# Altium schematic sheet np001.schdoc
size A2
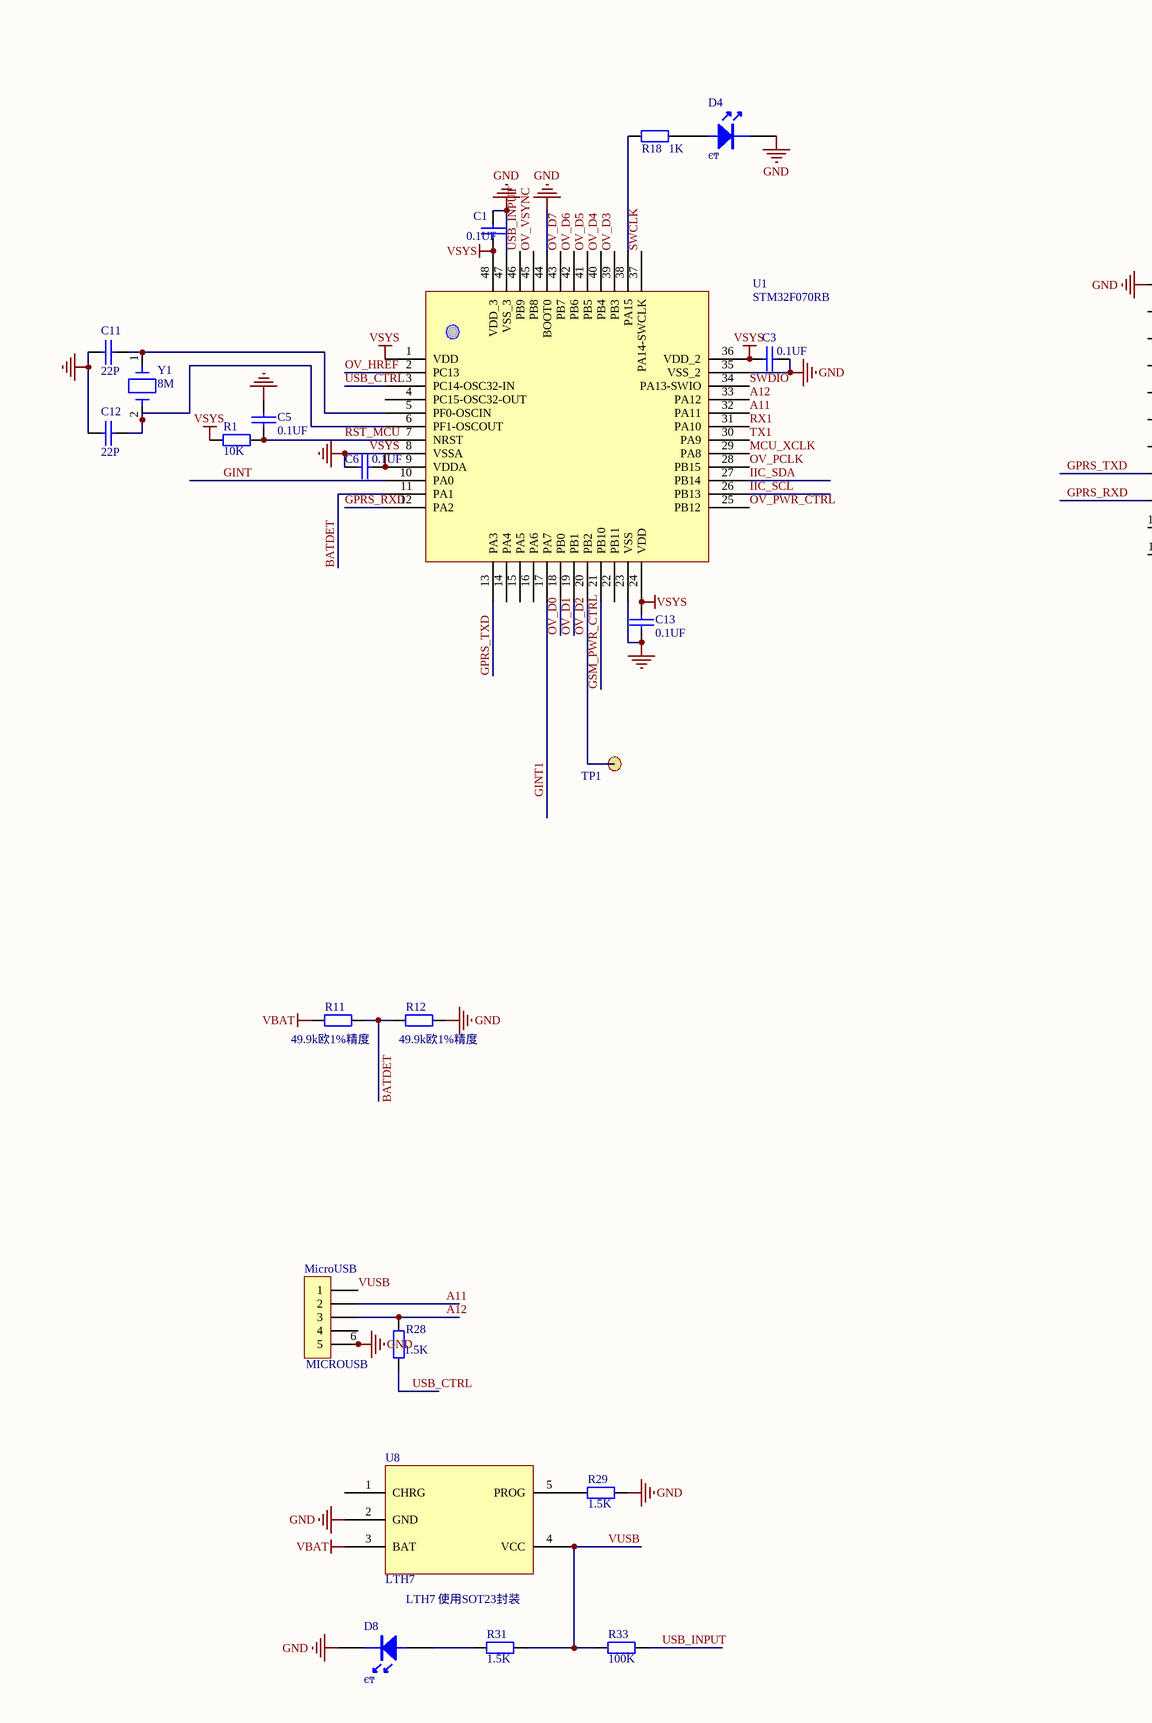
[diagram p0: np001.schdoc, left]
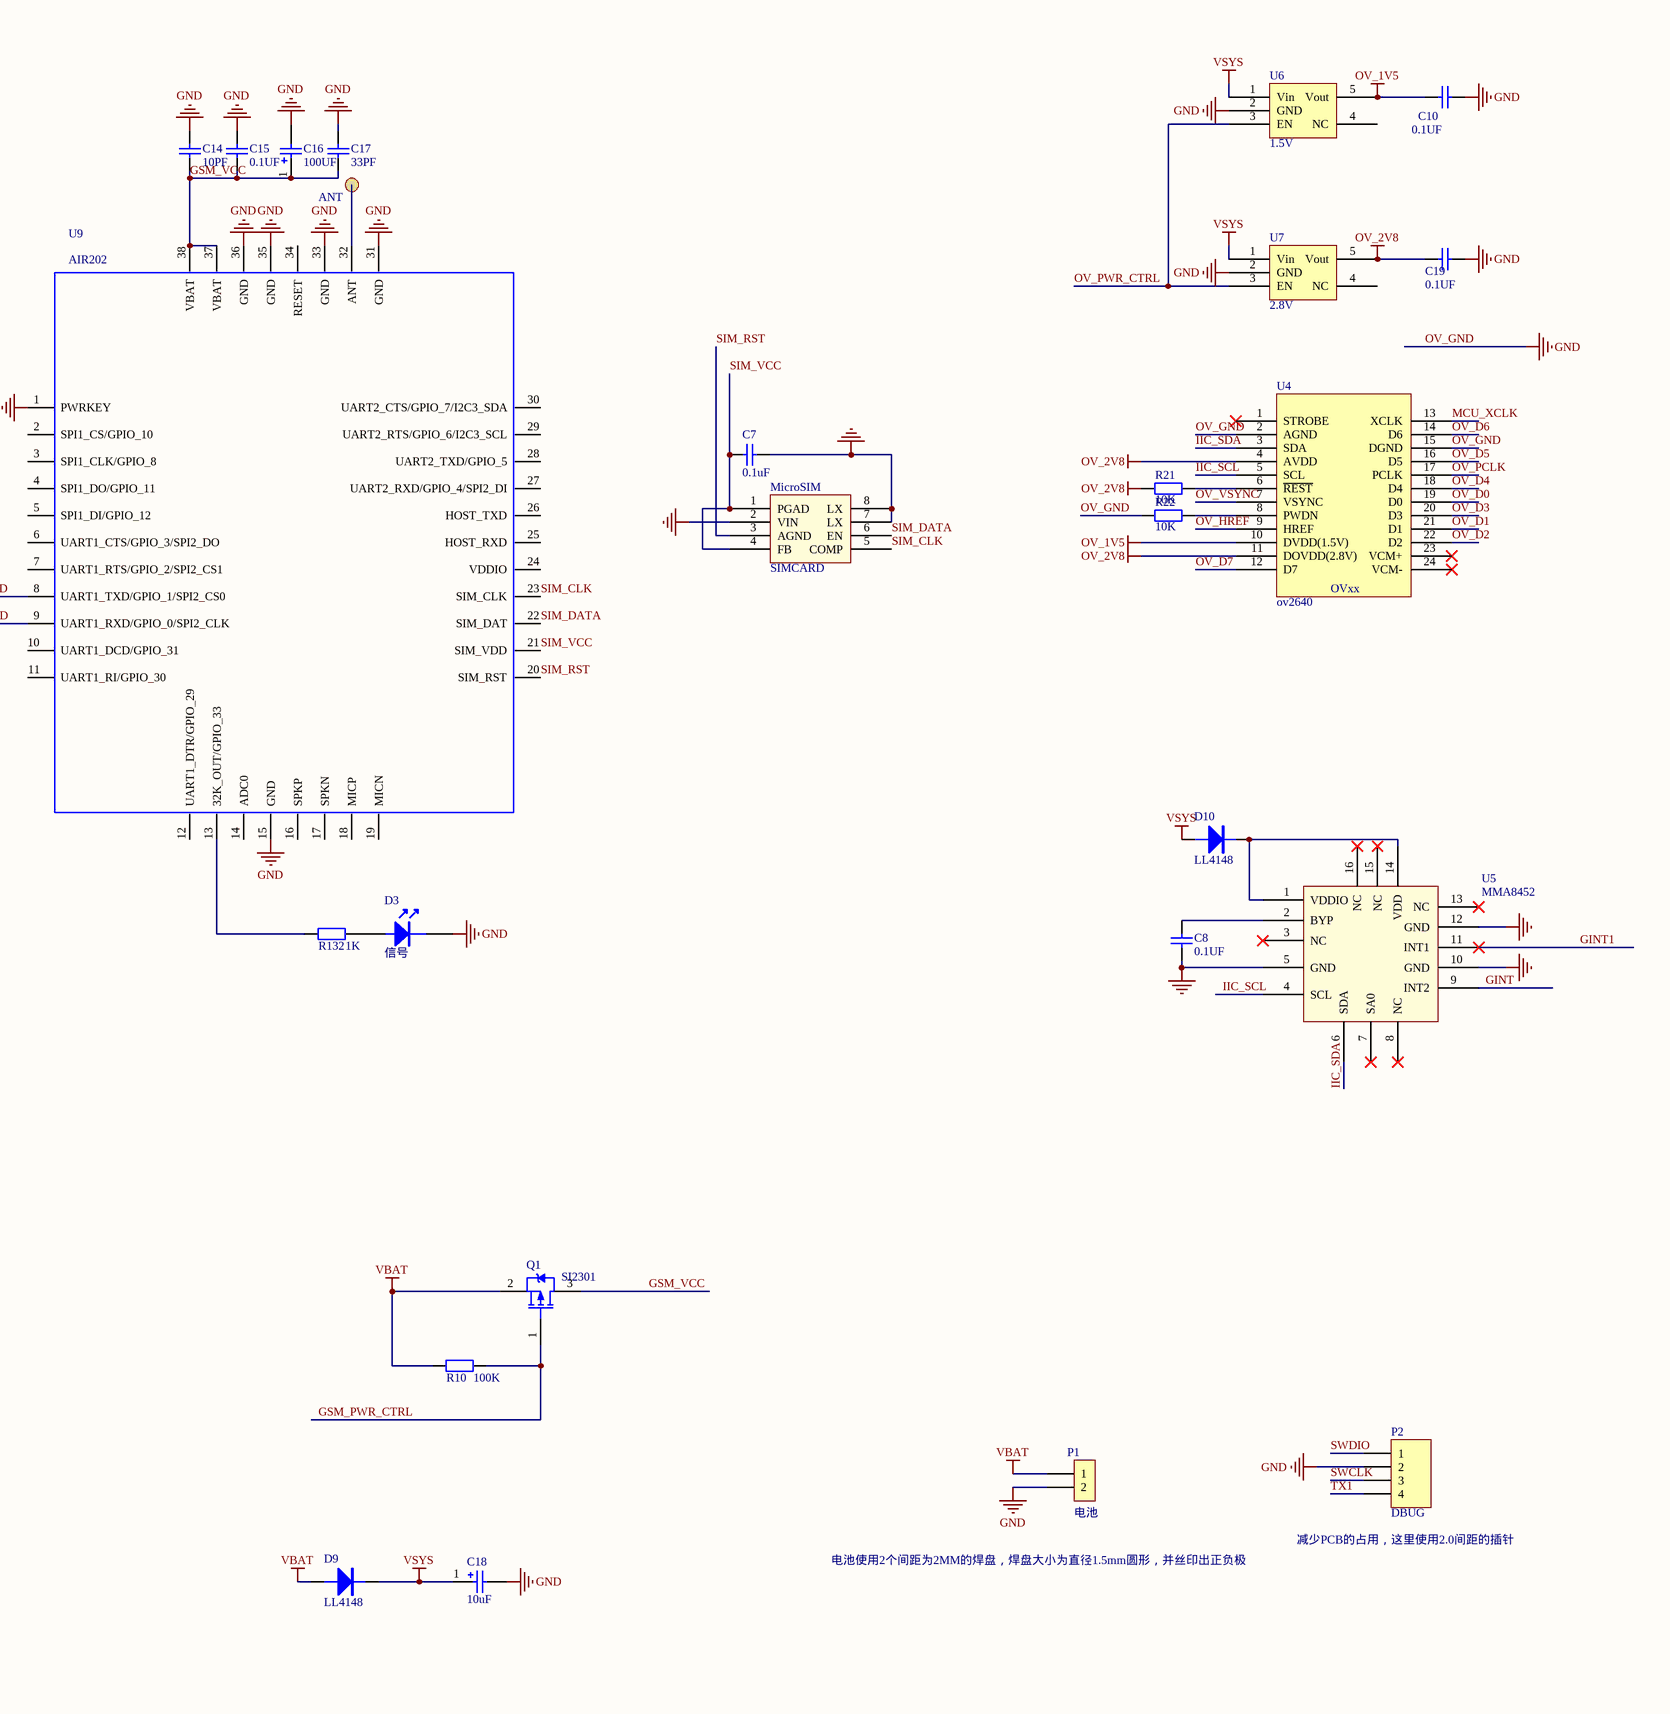
[diagram p1: np001.schdoc, right]

## Parts
ANT  TP  [CON1]  (value not drawn)
C1  0.1UF  [0603]
C3  0.1UF  [0603]
C5  0.1UF  [0603]
C6  0.1UF  [0603]
C7  value 0.1uF  [C0603]
C8  0.1UF  [0603]
C10  0.1UF  [0603]
C11  22P  [0603]
C12  22P  [0603]
C13  0.1UF  [0603]
C14  10PF  [0603]
C15  0.1UF  [0603]
C16  100UF  [C7343]
C17  33PF  [0603]
C18  10uF  [C3216_10V]
C19  0.1UF  [0603]
D3  信号  [LED0603]
D4  ϵͳ  [LED0603]
D8  ϵͳ  [LED0603]
D9  LL4148  [D1206]
D10  LL4148  [D1206]
MicroSIM  SIMCARD  [PCBComponent_1 - duplicate1]
MicroUSB  MICROUSB  [mircousb]
P1  电池  [HDR1X2]
P2  DBUG  [HDR1X4-2.0B]
Q1  SI2301  [SOT-23]
R1  10K  [0603]
R10  100K  [0603]
R11  49.9k欧1%精度  [0603]
R12  49.9k欧1%精度  [0603]
R18  1K  [0603]
R21  10K  [0603]
R22  10K  [0603]
R28  1.5K  [0603]
R29  1.5K  [0603]
R31  1.5K  [0603]
R33  100K  [0603]
R132  1K  [0603]
TP1  TP  [CON1]  (value not drawn)
U1  STM32F070RB  [LQFP48]
U4  ov2640  [OV2640]
U5  MMA8452  [LCC16]
U6  1.5V  [SOT753]
U7  2.8V  [SOT753]
U8  LTH7  [SOT-23-5]
U9  AIR202  [A6391_A11]
Y1  8M  [CRY_5032_2P]

## Nets
OV_1V5: C10.1 U4.10(DVDD(1.5V)) U6.5(Vout)
OV_2V8: C19.1 R21.2 U4.4(AVDD) U4.11(DOVDD(2.8V)) U7.5(Vout)
OV_GND: C1.2 C3.2 C5.2 C6.1 C7.2 C8.1 C10.2 C11.2 C12.2 C13.2 C14.2 C15.2 C16.2(N) C17.2 C18.2(N) C19.2 D3.2 D4.2 D8.2 MicroSIM.2(VIN) MicroSIM.7(LX) MicroSIM.8(LX) MicroUSB.5 MicroUSB.6 P1.2 P2.2 R12.2 R22.2 R29.2 U1.8(VSSA) U1.23(VSS) U1.35(VSS_2) U1.44(BOOT0) U1.47(VSS_3) U4.2(AGND) U4.15(DGND) U5.5(GND) U5.10(GND) U5.12(GND) U6.2(GND) U7.2(GND) U8.2(GND) U9.1(PWRKEY) U9.15(GND) U9.31(GND) U9.33(GND) U9.35(GND) U9.36(GND) U9.39(GND) U9.40(GND) U9.41(GND)  [also labelled GND]
VBAT: D9.1(A) P1.1 Q1.2(S) R10.1 R11.1 U8.3(BAT)
VSYS: C1.1 C3.1 C6.2 C13.1 C18.1(P) D9.2(K) D10.1(A) R1.1 U1.1(VDD) U1.9(VDDA) U1.24(VDD) U1.36(VDD_2) U1.48(VDD_3) U6.1(Vin) U7.1(Vin)
A11: MicroUSB.2 U1.32(PA11)
A12: MicroUSB.3 R28.1 U1.33(PA12)
BATDET: R11.2 R12.1 U1.11(PA1)
GINT: U1.10(PA0) U5.9(INT2)
GINT1: U1.17(PA7) U5.11(INT1)
GPRS_RXD: U1.12(PA2) U9.9(UART1_RXD/GPIO_0/SPI2_CLK)
GPRS_TXD: U1.13(PA3) U9.8(UART1_TXD/GPIO_1/SPI2_CS0)
GSM_PWR_CTRL: Q1.1(G) R10.2 U1.21(PB10)
GSM_VCC: C14.1 C15.1 C16.1(P) C17.1 Q1.3(D) U9.37(VBAT) U9.38(VBAT)
IIC_SCL: U1.26(PB13) U4.5(SCL) U5.4(SCL)
IIC_SDA: U1.27(PB14) U4.3(SDA) U5.6(SDA)
MCU_XCLK: U1.29(PA8) U4.13(XCLK)
OV_D0: U1.18(PB0) U4.19(D0)
OV_D1: U1.19(PB1) U4.21(D1)
OV_D2: TP1.1 U1.20(PB2) U4.22(D2)
OV_D3: U1.39(PB3) U4.20(D3)
OV_D4: U1.40(PB4) U4.18(D4)
OV_D5: U1.41(PB5) U4.16(D5)
OV_D6: U1.42(PB6) U4.14(D6)
OV_D7: U1.43(PB7) U4.12(D7)
OV_HREF: U1.2(PC13) U4.9(HREF)
OV_PCLK: U1.28(PB15) U4.17(PCLK)
OV_PWR_CTRL: U1.25(PB12) U6.3(EN) U7.3(EN)
OV_VSYNC: U1.45(PB8) U4.7(VSYNC)
RST_MCU: C5.1 R1.2 U1.7(NRST)
RX1: U1.31(PA10)
SIM_CLK: MicroSIM.5(COMP) U9.23(SIM_CLK)
SIM_DATA: MicroSIM.6(EN) U9.22(SIM_DAT)
SIM_RST: MicroSIM.3(AGND) U9.20(SIM_RST)
SIM_VCC: C7.1 MicroSIM.1(PGAD) MicroSIM.4(FB) U9.21(SIM_VDD)
SWCLK: P2.3 U1.37(PA14-SWCLK)
SWDIO: P2.1 U1.34(PA13-SWIO)
TX1: P2.4 U1.30(PA9)
USB_CTRL: R28.2 U1.3(PC14-OSC32-IN)
USB_INPUT: R33.2 U1.46(PB9)
VUSB: MicroUSB.1 R31.1 R33.1 U8.4(VCC)
NetANT_1: ANT.1 U9.32(ANT)
NetC8_2: C8.2 U5.2(BYP)
NetC11_1: C11.1 U1.5(PF0-OSCIN) Y1.1
NetC12_1: C12.1 U1.6(PF1-OSCOUT) Y1.2
NetD3_1: D3.1 R132.2
NetD4_1: D4.1 R18.2
NetD8_1: D8.1 R31.2
NetD10_2: D10.2(K) U5.1(VDDIO) U5.14(VDD)
NetR18_1: R18.1 U1.38(PA15)
NetR21_1: R21.1 U4.6(~{REST})
NetR22_1: R22.1 U4.8(PWDN)
NetR29_1: R29.1 U8.5(PROG)
NetR132_1: R132.1 U9.13(32K_OUT/GPIO_33)

Not connected (* = marked no-connect by the designer): MicroUSB 4; U1 4(PC15-OSC32-OUT) 14(PA4) 15(PA5) 16(PA6) 22(PB11); U4 1(STROBE)* 23(VCM+)* 24(VCM-)*; U5 3(NC)* 7(SA0)* 8(NC)* 13(NC)* 15(NC)* 16(NC)*; U6 4(NC); U7 4(NC); U8 1(CHRG); U9 2(SPI1_CS/GPIO_10) 3(SPI1_CLK/GPIO_8) 4(SPI1_DO/GPIO_11) 5(SPI1_DI/GPIO_12) 6(UART1_CTS/GPIO_3/SPI2_DO) 7(UART1_RTS/GPIO_2/SPI2_CS1) 10(UART1_DCD/GPIO_31) 11(UART1_RI/GPIO_30) 12(UART1_DTR/GPIO_29) 14(ADC0) 16(SPKP) 17(SPKN) 18(MICP) 19(MICN) 24(VDDIO) 25(HOST_RXD) 26(HOST_TXD) 27(UART2_RXD/GPIO_4/SPI2_DI) 28(UART2_TXD/GPIO_5) 29(UART2_RTS/GPIO_6/I2C3_SCL) 30(UART2_CTS/GPIO_7/I2C3_SDA) 34(RESET)

## Notes on the sheet
- 电池使用2个间距为2MM的焊盘，焊盘大小为直径1.5mm圆形，并丝印出正负极
- (near P2) 减少PCB的占用，这里使用2.0间距的插针
- LTH7 使用SOT23封装
- (in symbol ov2640) OVxx

## Library data of the parts
C1 C3 C5 C6 C11-C13 = CAP: Capacitor
C7 = Cap: Capacitor; Published: 8-Jun-2000; LatestRevisionDate: 17-Jul-2002; LatestRevisionNote: Re-released for DXP Platform.; PackageReference: RAD-0.3; Publisher: Altium Limited
C8 = Cap
C10 C14 C15 C17 C19 = CAP
C16 C18 = Cap_+
D3 D4 D8 = LED
D9 D10 = DIODE
MicroSIM = aoz1073
MicroUSB = CON5: Connector
P1 = Header_2
P2 = Header 4H: Header, 4-Pin, Right Angle; LatestRevisionDate: 17-Jul-2002; LatestRevisionNote: Re-released for DXP Platform.; Publisher: Altium Limited
Q1 = PMOS-2: P-Channel Power MOSFET; Note: Pin 4 not drawn and electrically connected to Pin 2.; Published: 8-Jun-2000; LatestRevisionDate: 17-Jul-2002; LatestRevisionNote: Re-released for DXP Platform.; DatasheetVersion: PD-9.390D; PackageReference: TO-220AB; Publisher: Altium Limited; Code_JEDEC: TO-220-AB; ComponentLink1Description: Manufacturer Link; ComponentLink1URL: http://www.irf.com/
R1 R10-R12 R18 R21 R22 R33 R132 = Res2: Resistor; Published: *; LatestRevisionDate: *; LatestRevisionNote: *; PackageReference: *; Publisher: *; PackageDescription: *; Value: *
R28 R29 R31 = Res_SMT
U1 = STM32070RB
U6 U7 = NCP699_LDO
U9 = A6391_A11: Geometry.Height: 2.3 MM; PCB DECAL: A6391_A11
Y1 = CRYTAL